# Altium schematic sheet Main_Schematic.SchDoc
size A4; Date: 1.06.2026; Author: Jan Rutkowski; CompanyName: KN_HARDWIRE; SheetNumber: 1; SheetTotal: 4
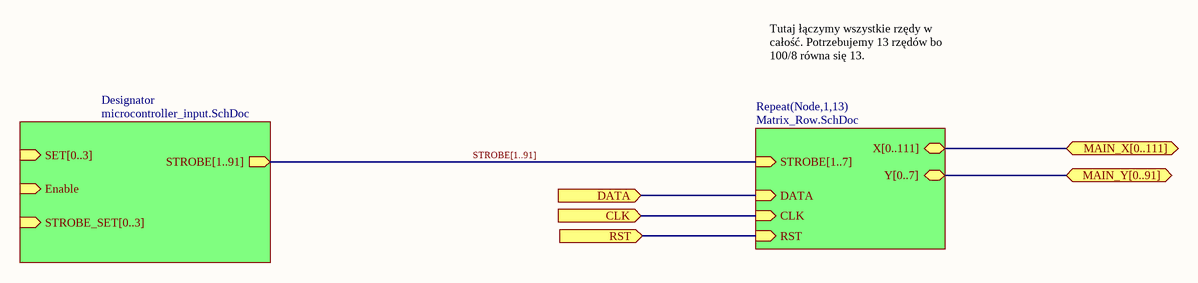
[diagram p0: Main_Schematic.SchDoc]

## Sub-sheets
Designator = microcontroller_input.SchDoc: SET[0..3] (in), Enable (in), STROBE_SET[0..3] (in), STROBE[1..91] (out)
Repeat(Node,1,13) = Matrix_Row.SchDoc: CLK (in), DATA (in), RST (in), STROBE[1..7] (in), X[0..111] (bidir), Y[0..7] (bidir)

## Ports
CLK (in), DATA (in), MAIN_X[0..111] (bidir), MAIN_Y[0..91] (bidir), RST (in)

## Nets
CLK: port CLK, sheet Repeat(Node,1,13)/CLK
DATA: port DATA, sheet Repeat(Node,1,13)/DATA
RST: port RST, sheet Repeat(Node,1,13)/RST

## Buses and harness runs
bus port MAIN_X[0..111] = sheet Repeat(Node,1,13)/X[0..111]
bus port MAIN_Y[0..91] = sheet Repeat(Node,1,13)/Y[0..7]
bus STROBE[1..91] = sheet Designator/STROBE[1..91] = sheet Repeat(Node,1,13)/STROBE[1..7]

## Notes on the sheet
- Tutaj łączymy wszystkie rzędy w całość. Potrzebujemy 13 rzędów bo 100/8 równa się 13.
- Text
- Company Confidential / Not for distribution
- Project name:
- Document Name:
- Free Documents
- Sheet1.SchDoc
- Designer Name:
- Jan Rutkowski
- Date/Time:
- 10.03.26
- Revison:
- 1